# EAGLE schematic prototype_total_schematic (EAGLE 8.4.1)

## Sheet 1 of 2: Peripherals
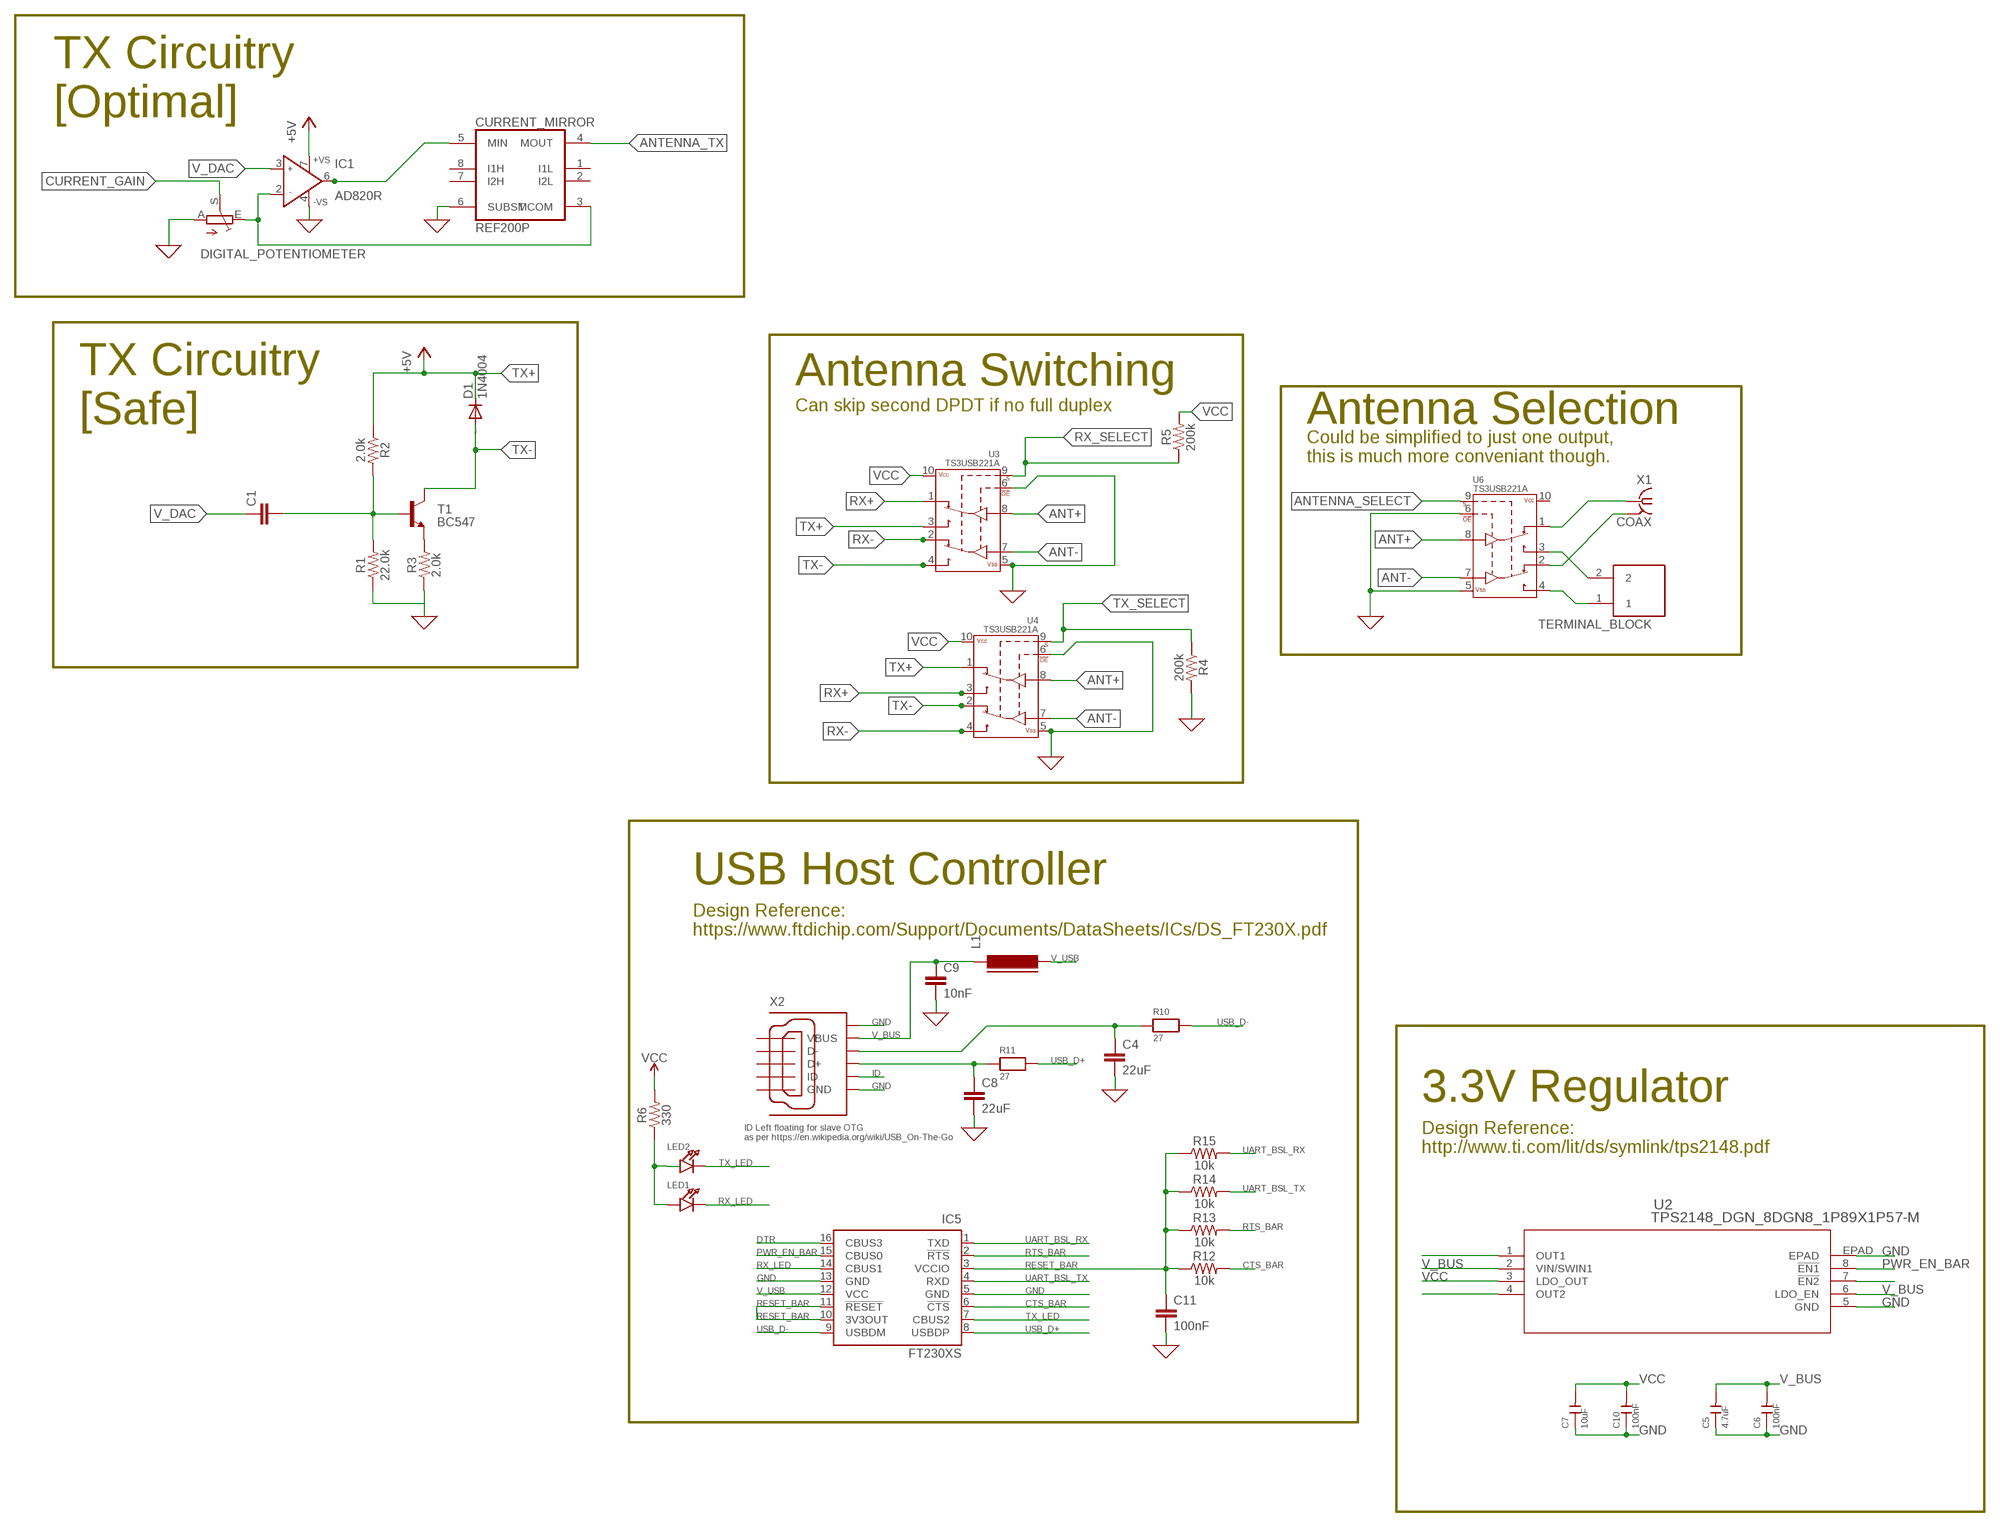
[diagram p0: schematic, sheet 1]

### Parts
C1  CAPACITOR_0201_M  [RESC0201_M]
C4  22uF  22UF-0805-6.3V-20%  [0805]
C5  4.7uF  CERAMIC-100NF-50V-10%-X7R(0805)  [C0805]
C6  100nF  CERAMIC-100NF-50V-10%-X7R(0805)  [C0805]
C7  10uF  CERAMIC-100NF-50V-10%-X7R(0805)  [C0805]
C8  22uF  22UF-0805-6.3V-20%  [0805]
C9  10nF  22UF-0805-6.3V-20%  [0805]
C10  100nF  CERAMIC-100NF-50V-10%-X7R(0805)  [C0805]
C11  100nF  22UF-0805-6.3V-20%  [0805]
CURRENT_MIRROR  REF200P  [DIL08]
D1  1N4004  [DO41-10]
DIGITAL_POTENTIOMETER  TRIM_1234-S64YW  [S64YW]
IC1  AD820R  [SO8]
IC5  FT230XS  [SSOP16]
L1  FERRITE-0805  [FB805]
LED1  LED0805  [CHIPLED_0805]
LED2  LED0805  [CHIPLED_0805]
R1  22.0k  2.0KOHM-0603-1/10W-5%  [0603]
R2  2.0k  2.0KOHM-0603-1/10W-5%  [0603]
R3  2.0k  2.0KOHM-0603-1/10W-5%  [0603]
R4  200k  2.0KOHM-0603-1/10W-5%  [0603]
R5  200k  2.0KOHM-0603-1/10W-5%  [0603]
R6  330  2.0KOHM-0603-1/10W-5%  [0603]
R10  27  RESISTOR0805_NOTHERMALS  [0805_NOTHERMALS]
R11  27  RESISTOR0805_NOTHERMALS  [0805_NOTHERMALS]
R12  10k  2.0KOHM-0603-1/10W-5%  [0603]
R13  10k  2.0KOHM-0603-1/10W-5%  [0603]
R14  10k  2.0KOHM-0603-1/10W-5%  [0603]
R15  10k  2.0KOHM-0603-1/10W-5%  [0603]
T1  BC547  [TO92]
TERMINAL_BLOCK  ED555/2DS  [ED555/2DS]
U2  TPS2148_DGN_8DGN8_1P89X1P57-M  [DGN8_1P89X1P57-M]
U3  TS3USB221A  [QFN-10-RSE]
U4  TS3USB221A  [QFN-10-RSE]
U6  TS3USB221A  [QFN-10-RSE]
X1  COAX  [MMCX-J-P-X-ST-EM1-MKT]
X2  GHI-CONNECTORS_10118192-0001LF  [GHI-CONNECTORS_10118192-0001LF(MICRO-USB-B-AMPHENOL-FCI)]

### Nets
0: C4.2 C8.2 C9.2 C11.2 CURRENT_MIRROR.6(SUBST) DIGITAL_POTENTIOMETER.A IC1.4(-VS) R1.1 R3.1 R4.2 U3.5(VSS) U3.6(!OE) U4.5(VSS) U4.6(!OE) U6.5(VSS) U6.6(!OE) ; supply symbol labelled GND
ANT+: U3.8(D+) U4.8(D+) U6.8(D+)
ANT-: U3.7(D-) U4.7(D-) U6.7(D-)
ANTENNA_SELECT: U6.9(S)
ANTENNA_TX: CURRENT_MIRROR.4(MOUT)
CTS_BAR: IC5.6(!CTS) R12.2
CURRENT_GAIN: DIGITAL_POTENTIOMETER.S
DTR: IC5.16(CBUS3) ; also sheet 2
GND: C5.1 C6.1 C7.1 C10.1 IC5.5(GND) IC5.13(GND) U2.5(GND) U2.EPAD X2.CGND1(SGND1) X2.CGND6(SGND6)
ID: X2.CGND2(SGND2)
N$1: TERMINAL_BLOCK.1 U6.4(2D-)
N$2: CURRENT_MIRROR.3(MCOM) DIGITAL_POTENTIOMETER.E IC1.2(IN-)
N$3: LED1.A LED2.A R6.1
N$4: CURRENT_MIRROR.5(MIN) IC1.6(OUT)
N$5: C8.1 R11.1 X2.CGND3(SGND3)
N$6: U6.2(1D-) X1.2@1(GND)
N$7: U6.1(1D+) X1.1
N$8: TERMINAL_BLOCK.2 U6.3(2D+)
N$12: C4.1 R10.1 X2.CGND4(SGND4)
N$13: R3.2 T1.1(E)
N$14: C1.2 R1.2 R2.2 T1.2(B)
N$17: U2.7(!EN2)
N$23: U2.1(OUT1)
N$26: U2.4(OUT2)
PWR_EN_BAR: IC5.15(CBUS0) U2.8(!EN1)
RESET_BAR: C11.1 IC5.3(VCCIO) IC5.10(3V3OUT) IC5.11(!RESET) R12.1 R13.1 R14.1 R15.1
RTS_BAR: IC5.2(!RTS) R13.2 ; also sheet 2
RX+: U3.1(1D+) U4.3(2D+)
RX-: U3.2(1D-) U4.4(2D-)
RX_LED: IC5.14(CBUS1) LED1.C
RX_SELECT: R5.1 U3.9(S)
TX+: D1.C IC1.7(+VS) R2.1 U3.3(2D+) U4.1(1D+) ; supply symbol labelled +5V
TX-: D1.A T1.3(C) U3.4(2D-) U4.2(1D-)
TX_LED: IC5.7(CBUS2) LED2.C
TX_SELECT: R4.1 U4.9(S)
UART_BSL_RX: IC5.1(TXD) R15.2 ; also sheet 2
UART_BSL_TX: IC5.4(RXD) R14.2 ; also sheet 2
USB_D+: IC5.8(USBDP) R11.2
USB_D-: IC5.9(USBDM) R10.2
V_BUS: C5.2 C6.2 C9.1 L1.1 U2.2(VIN/SWIN1) U2.6(LDO_EN) X2.CGND5(SGND5)
V_DAC: C1.1 IC1.3(IN+)
V_USB: IC5.12(VCC) L1.2
VCC: C7.2 C10.2 R5.2 R6.2 U2.3(LDO_OUT) U3.10(VCC) U4.10(VCC)
Unconnected: CURRENT_MIRROR.1(I1L) CURRENT_MIRROR.2(I2L) CURRENT_MIRROR.7(I2H) CURRENT_MIRROR.8(I1H) DIGITAL_POTENTIOMETER.S@1(S) U6.10(VCC) X2.D+ X2.D- X2.GND X2.ID X2.VBUS

### Notes on the sheet
- TX Circuitry
  [Optimal]
- Antenna Switching
- Can skip second DPDT if no full duplex
- TX Circuitry
  [Safe]
- Antenna Selection
- Could be simplified to just one output,
  this is much more conveniant though.
- USB Host Controller
- Design Reference:
  https://www.ftdichip.com/Support/Documents/DataSheets/ICs/DS_FT230X.pdf
- 3.3V Regulator
- ID Left floating for slave OTG
  as per https://en.wikipedia.org/wiki/USB_On-The-Go
- Design Reference:
  http://www.ti.com/lit/ds/symlink/tps2148.pdf

## Sheet 2 of 2: MCU
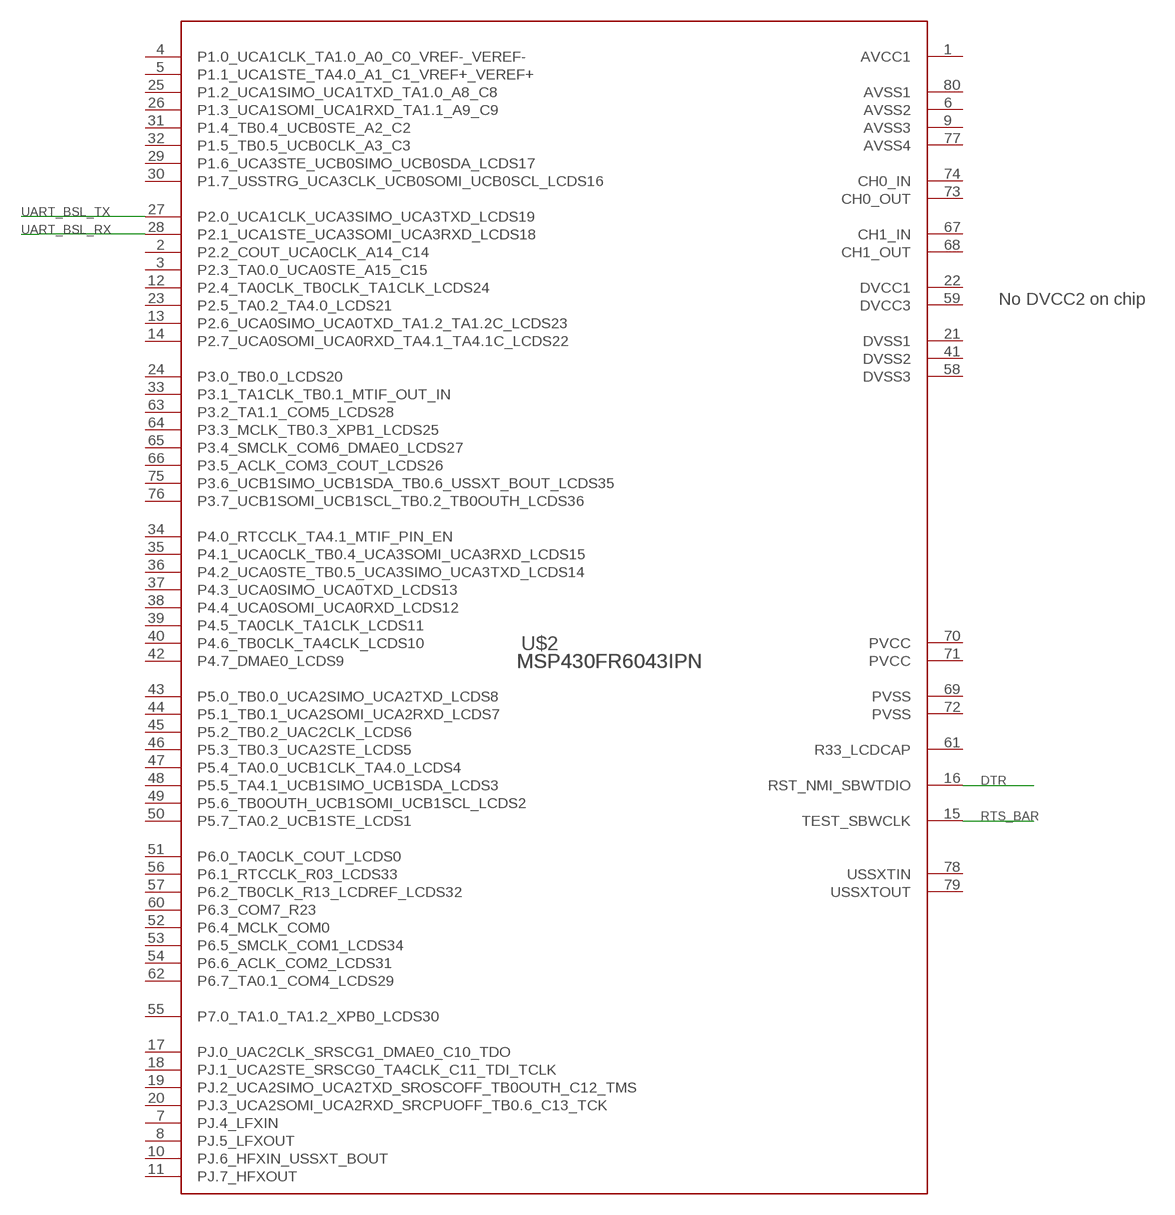
[diagram p1: schematic, sheet 2]

### Parts
U$2  MSP430FR6043IPN  [PN0080A_N]

### Nets
DTR: U$2.16(RST_NMI_SBWTDIO) ; also sheet 1
RTS_BAR: U$2.15(TEST_SBWCLK) ; also sheet 1
UART_BSL_RX: U$2.28(P2.1_UCA1STE_UCA3SOMI_UCA3RXD_LCDS18) ; also sheet 1
UART_BSL_TX: U$2.27(P2.0_UCA1CLK_UCA3SIMO_UCA3TXD_LCDS19) ; also sheet 1
Unconnected: U$2.2(P2.2_COUT_UCA0CLK_A14_C14) U$2.3(P2.3_TA0.0_UCA0STE_A15_C15) U$2.4(P1.0_UCA1CLK_TA1.0_A0_C0_VREF-_VEREF-) U$2.5(P1.1_UCA1STE_TA4.0_A1_C1_VREF+_VEREF+) U$2.7(PJ.4_LFXIN) U$2.8(PJ.5_LFXOUT) U$2.10(PJ.6_HFXIN_USSXT_BOUT) U$2.11(PJ.7_HFXOUT) U$2.12(P2.4_TA0CLK_TB0CLK_TA1CLK_LCDS24) U$2.13(P2.6_UCA0SIMO_UCA0TXD_TA1.2_TA1.2C_LCDS23) U$2.14(P2.7_UCA0SOMI_UCA0RXD_TA4.1_TA4.1C_LCDS22) U$2.17(PJ.0_UAC2CLK_SRSCG1_DMAE0_C10_TDO) U$2.18(PJ.1_UCA2STE_SRSCG0_TA4CLK_C11_TDI_TCLK) U$2.19(PJ.2_UCA2SIMO_UCA2TXD_SROSCOFF_TB0OUTH_C12_TMS) U$2.20(PJ.3_UCA2SOMI_UCA2RXD_SRCPUOFF_TB0.6_C13_TCK) U$2.23(P2.5_TA0.2_TA4.0_LCDS21) U$2.24(P3.0_TB0.0_LCDS20) U$2.25(P1.2_UCA1SIMO_UCA1TXD_TA1.0_A8_C8) U$2.26(P1.3_UCA1SOMI_UCA1RXD_TA1.1_A9_C9) U$2.29(P1.6_UCA3STE_UCB0SIMO_UCB0SDA_LCDS17) U$2.30(P1.7_USSTRG_UCA3CLK_UCB0SOMI_UCB0SCL_LCDS16) U$2.31(P1.4_TB0.4_UCB0STE_A2_C2) U$2.32(P1.5_TB0.5_UCB0CLK_A3_C3) U$2.33(P3.1_TA1CLK_TB0.1_MTIF_OUT_IN) U$2.34(P4.0_RTCCLK_TA4.1_MTIF_PIN_EN) U$2.35(P4.1_UCA0CLK_TB0.4_UCA3SOMI_UCA3RXD_LCDS15) U$2.36(P4.2_UCA0STE_TB0.5_UCA3SIMO_UCA3TXD_LCDS14) U$2.37(P4.3_UCA0SIMO_UCA0TXD_LCDS13) U$2.38(P4.4_UCA0SOMI_UCA0RXD_LCDS12) U$2.39(P4.5_TA0CLK_TA1CLK_LCDS11) U$2.40(P4.6_TB0CLK_TA4CLK_LCDS10) U$2.42(P4.7_DMAE0_LCDS9) U$2.43(P5.0_TB0.0_UCA2SIMO_UCA2TXD_LCDS8) U$2.44(P5.1_TB0.1_UCA2SOMI_UCA2RXD_LCDS7) U$2.45(P5.2_TB0.2_UAC2CLK_LCDS6) U$2.46(P5.3_TB0.3_UCA2STE_LCDS5) U$2.47(P5.4_TA0.0_UCB1CLK_TA4.0_LCDS4) U$2.48(P5.5_TA4.1_UCB1SIMO_UCB1SDA_LCDS3) U$2.49(P5.6_TB0OUTH_UCB1SOMI_UCB1SCL_LCDS2) U$2.50(P5.7_TA0.2_UCB1STE_LCDS1) U$2.51(P6.0_TA0CLK_COUT_LCDS0) U$2.52(P6.4_MCLK_COM0) U$2.53(P6.5_SMCLK_COM1_LCDS34) U$2.54(P6.6_ACLK_COM2_LCDS31) U$2.55(P7.0_TA1.0_TA1.2_XPB0_LCDS30) U$2.56(P6.1_RTCCLK_R03_LCDS33) U$2.57(P6.2_TB0CLK_R13_LCDREF_LCDS32) U$2.60(P6.3_COM7_R23) U$2.61(R33_LCDCAP) U$2.62(P6.7_TA0.1_COM4_LCDS29) U$2.63(P3.2_TA1.1_COM5_LCDS28) U$2.64(P3.3_MCLK_TB0.3_XPB1_LCDS25) U$2.65(P3.4_SMCLK_COM6_DMAE0_LCDS27) U$2.66(P3.5_ACLK_COM3_COUT_LCDS26) U$2.69(PVSS) U$2.70(PVCC) U$2.71(PVCC) U$2.75(P3.6_UCB1SIMO_UCB1SDA_TB0.6_USSXT_BOUT_LCDS35) U$2.76(P3.7_UCB1SOMI_UCB1SCL_TB0.2_TB0OUTH_LCDS36)

## Power pins joined to a net without a drawn wire
AVCC1: U$2.1(AVCC1)
AVSS1: U$2.80(AVSS1)
AVSS2: U$2.6(AVSS2)
AVSS3: U$2.9(AVSS3)
AVSS4: U$2.77(AVSS4)
CH0_IN: U$2.74(CH0_IN)
CH0_OUT: U$2.73(CH0_OUT)
CH1_IN: U$2.67(CH1_IN)
CH1_OUT: U$2.68(CH1_OUT)
DVCC1: U$2.22(DVCC1)
DVCC3: U$2.59(DVCC3)
DVSS1: U$2.21(DVSS1)
DVSS2: U$2.41(DVSS2)
DVSS3: U$2.58(DVSS3)
GND: X1.2@2(GND) X1.2@3(GND) X1.2@4(GND)
PVSS: U$2.72(PVSS)
USSXTIN: U$2.78(USSXTIN)
USSXTOUT: U$2.79(USSXTOUT)

## Library data of the parts
C1 = Nordic_nRF:CAPACITOR: Generic chip capacitor
C4 C8 = SparkFun-Capacitors:22UF: 22µF ceramic capacitors A capacitor is a passive two-terminal electrical component used to store electrical energy temporarily in an electric field.; PROD_ID: CAP-08402
C5-C7 C10 = OPL_Capacitor:CERAMIC-100NF-50V-10%-X7R(0805): 302010165; MPN: CC0805KRX7R9BB104; VALUE: 100nf
C9 C11 = SparkFun-Capacitors:22UF: 22µF ceramic capacitors A capacitor is a passive two-terminal electrical component used to store electrical energy temporarily in an electric field.; PROD_ID: CAP-08402; VALUE: 22uF
CURRENT_MIRROR = burr-brown-3:REF200: Dual Current Source/Current Sink
D1 = diode:1N4004: DIODE general purpose rectifier, 1 A
DIGITAL_POTENTIOMETER = pot:TRIM_1234-: POTENTIOMETER
IC1 = analog-devices:AD820: Single-Supply, Rail-to-Rail, Low Power, FET Input Op Amp Source: http://www.analog.com/static/imported-files/data_sheets/AD820.pdf; OC_FARNELL: 1838867; OC_NEWARK: unknown
IC5 = ftdi:FT230X: USB to BASIC UART IC Auto generated by make-symbol-device-package-bsdl.ulp Rev. 43 Source: Data sheet <http://www.ftdichip.com/Support/Documents/DataSheets/ICs/DS_FT230X.pdf>
L1 = dp_devices:FERRITE: Ferrite bead in various packages
LED1 LED2 = microbuilder:LED: LED 0603 - 0603 Surface Mount Package 2mA: Green LED - Low Power (3.9mcd, 2ma, 1.7Vf) - Digikey: 475-2709-2-ND Orange LED - Low Power (9.8mcd, 2ma, 1.8Vf) - Digikey: 475-1194-2-ND Red LED - Low Power (5mcd, 2ma, 1.8Vf) - Digikey: 475-1195-2-ND Yellow LED - Low Power (7mcd, 2ma, 1.8Vf) - Digikey: 475-1196-2-ND 5mA: Blue LED - Low Power (17mcd, 5ma, 2.9Vf) - Digikey: LNJ937W8CRACT-ND 0805 - 0805 Surface Mount Package 2mA: Red LED (8.8mcd, 2mA, 1.8Vf, Clear) - Low Power [Digikey: 475-2510-1-ND] Green LED (5mcd, 2mA, 1.8Vf, Clear) - Low Power [Digikey: 475-2730-1-ND] Yellow LED (11.3mcd, 2mA, 1.8Vf, Clear) - Low Power [Digikey: 475-2555-1-ND] 20mA: Red LED (104mcd, 20mA, Diffused) - LS R976 [Digikey: 475-1278-6-ND] Red LED (12mcd, 20mA, 2.0Vf, Clear) - APT2012EC [Digikey: 754-1128-1-ND] Green LED (15mcd, 20mA, 2.2Vf, Clear) - APT2012GC [Digikey: 754-1131-1-ND] Orange LED (160mcd, 20mA, 2.1Vf, Clear) - APT2012SECK [Digikey: 754-1130-1-ND] 1206 - 1206 Surface Mount Package Green LED (26mcd, 20mA, Diffused) - LG N971 [Digikey: 475-1407-6-ND] Red LED (15mcd, 20mA, Diffused) - LH N974 [Digikey: 475-1416-6-ND]
R1 R4-R6 R12-R15 = SparkFun-Resistors:2.0KOHM: 2kΩ resistor A resistor is a passive two-terminal electrical component that implements electrical resistance as a circuit element. Resistors act to reduce current flow, and, at the same time, act to lower voltage levels within circuits. - Wikipedia; PROD_ID: RES-08296; VALUE: 2.0k
R2 R3 = SparkFun-Resistors:2.0KOHM: 2kΩ resistor A resistor is a passive two-terminal electrical component that implements electrical resistance as a circuit element. Resistors act to reduce current flow, and, at the same time, act to lower voltage levels within circuits. - Wikipedia; PROD_ID: RES-08296
R10 R11 = microbuilder:RESISTOR: Resistors 0402 - 0402 Surface Mount Package 22 Ohm 1% 1/16W [Digikey: 311-22.0LRTR-ND] 33 Ohm 5% 1/16W 1.0K 5% 1/16W 1.5K 5% 1/16W 2.0K 1% 1/16W 10.0K 1% 1/16W [Digikey: 311-10.0KLRTR-ND] 10.0K 5% 1/16W [Digikey: RMCF0402JT10K0TR-ND] 12.1K 1% 1/16W [Digikey: 311-22.0LRTR-ND] 100.0K 5% 1/16W 0603 - 0603 Surface Mount Package 0 Ohm 1/10 Watt 1% Resistor 15 Ohm 1/10 Watt 1% Resistor 33 Ohm 1/10 Watt 1% Resistor 49.9 Ohm 1/10 Watt 1% Resistor 100 Ohm 1/10 Watt 1% Resistor 150 Ohm 1/10 Watt 1% Resistor 240 Ohm 1/10 Watt 1% Resistor 390 Ohm 1/10 Watt 1% Resistor 560 Ohm 1/10 Watt 1% Resistor 680 Ohm 1/10 Watt 1% Resistor 750 Ohm 1/10 Watt 1% Resistor 1.0K Ohm 1/10 Watt 1% Resistor 1.5K Ohm 1/10 Watt 1% Resistor 2.0K Ohm 1/10 Watt 1% Resistor 2.2K Ohm 1/10 Watt 1% Resistor 3.3K Ohm 1/10 Watt 1% Resistor 4.7K Ohm 1/10 Watt 1% Resistor 10.0K Ohm 1/10 Watt 1% Resistor 12.0K Ohm 1/10 Watt 1% Resistor 12.1K Ohm 1/10 Watt 1% Resistor 20.0K Ohm 1/10 Watt 1% Resistor 33.0K Ohm 1/10 Watt 1% Resistor 100.0K Ohm 1/10 Watt 1% Resistor 0805 - 0805 Surface Mount Package 0 Ohm 1/8 Watt 1% Resistor 33 Ohm 1/8 Watt 1% Resistor 100 Ohm 1/8 Watt 1% Resistor 150 Ohm 1/8 Watt 1% Resistor 200 Ohm 1/8 Watt 1% Resistor 240 Ohm 1/8 Watt 1% Resistor 330 Ohm 1/8 Watt 1% Resistor 390 Ohm 1/8 Watt 1% Resistor 470 Ohm 1/8 Watt 1% Resistor 1.0K Ohm 1/8 Watt 1% Resistor 1.5K Ohm 1/8 Watt 1% Resistor 2.0K Ohm 1/8 Watt 1% Resistor 4.7K Ohm 1/8 Watt 1% Resistor 5.1K Ohm 1/8 Watt 1% Resistor 5.6K Ohm 1/8 Watt 1% Resistor 10.0K Ohm 1/8 Watt 1% Resistor 22.0K Ohm 1/8 Watt 1% Resistor 33.0K Ohm 1/8 Watt 1% Resistor 100K Ohm 1/8 Watt 1% Resistor 1206 - 1206 Surface Mount Package 2012 - 2010 Surface Mount Package 0.11 Ohm 1/2 Watt 1% Resistor - Digikey: RHM.11UCT-ND
T1 = transistor:BC547: NPN TRANSISTOR
TERMINAL_BLOCK = DC_LOAD_AU:ED555/2DS: 2-Pin Terminal Block 3.5mm pitch 6A
U2 = TTE:TPS2148_DGN_8; MANUFACTURER_PART_NUMBER: TPS2148_DGN_8; VENDOR: Texas Instruments
U3 U4 U6 = SparkFun-IC-Special-Function:TS3USB221A: DPDT Analog Mux DPDT Analog Mux Vcc 2.5 to 3.3V Passes up to 5.5V at 3.3V supply 900MHz BW, 6Ω switch resistance SparkFun Products SparkFun FTDI SmartBasic <https://www.sparkfun.com/products/12935> (DEV-12935); PROD_ID: IC-12115
U$2 = TTE:MSP430FR6043IPN
X1 = con-samtec:COAX: MMCX STRAIGHT, EDGE MOUNT JACK- 50 OHM Source: http://www.samtec.com/ftppub/cpdf/MMCX-J-P-X-ST-EM1-MKT.pdf; OC_FARNELL: unknown; OC_NEWARK: unknown
X2 = BeagleBone_Black_Wireless:GHI-CONNECTORS_10118192-0001LF: Amphenol FCI Micro USB Type B Complete Surface Mount (SMT) no guide holes